# Altium schematic sheet PAGE1-CONTENTS.SchDoc
size A3; DocumentNumber: 1; SheetNumber: 1; SheetTotal: 2
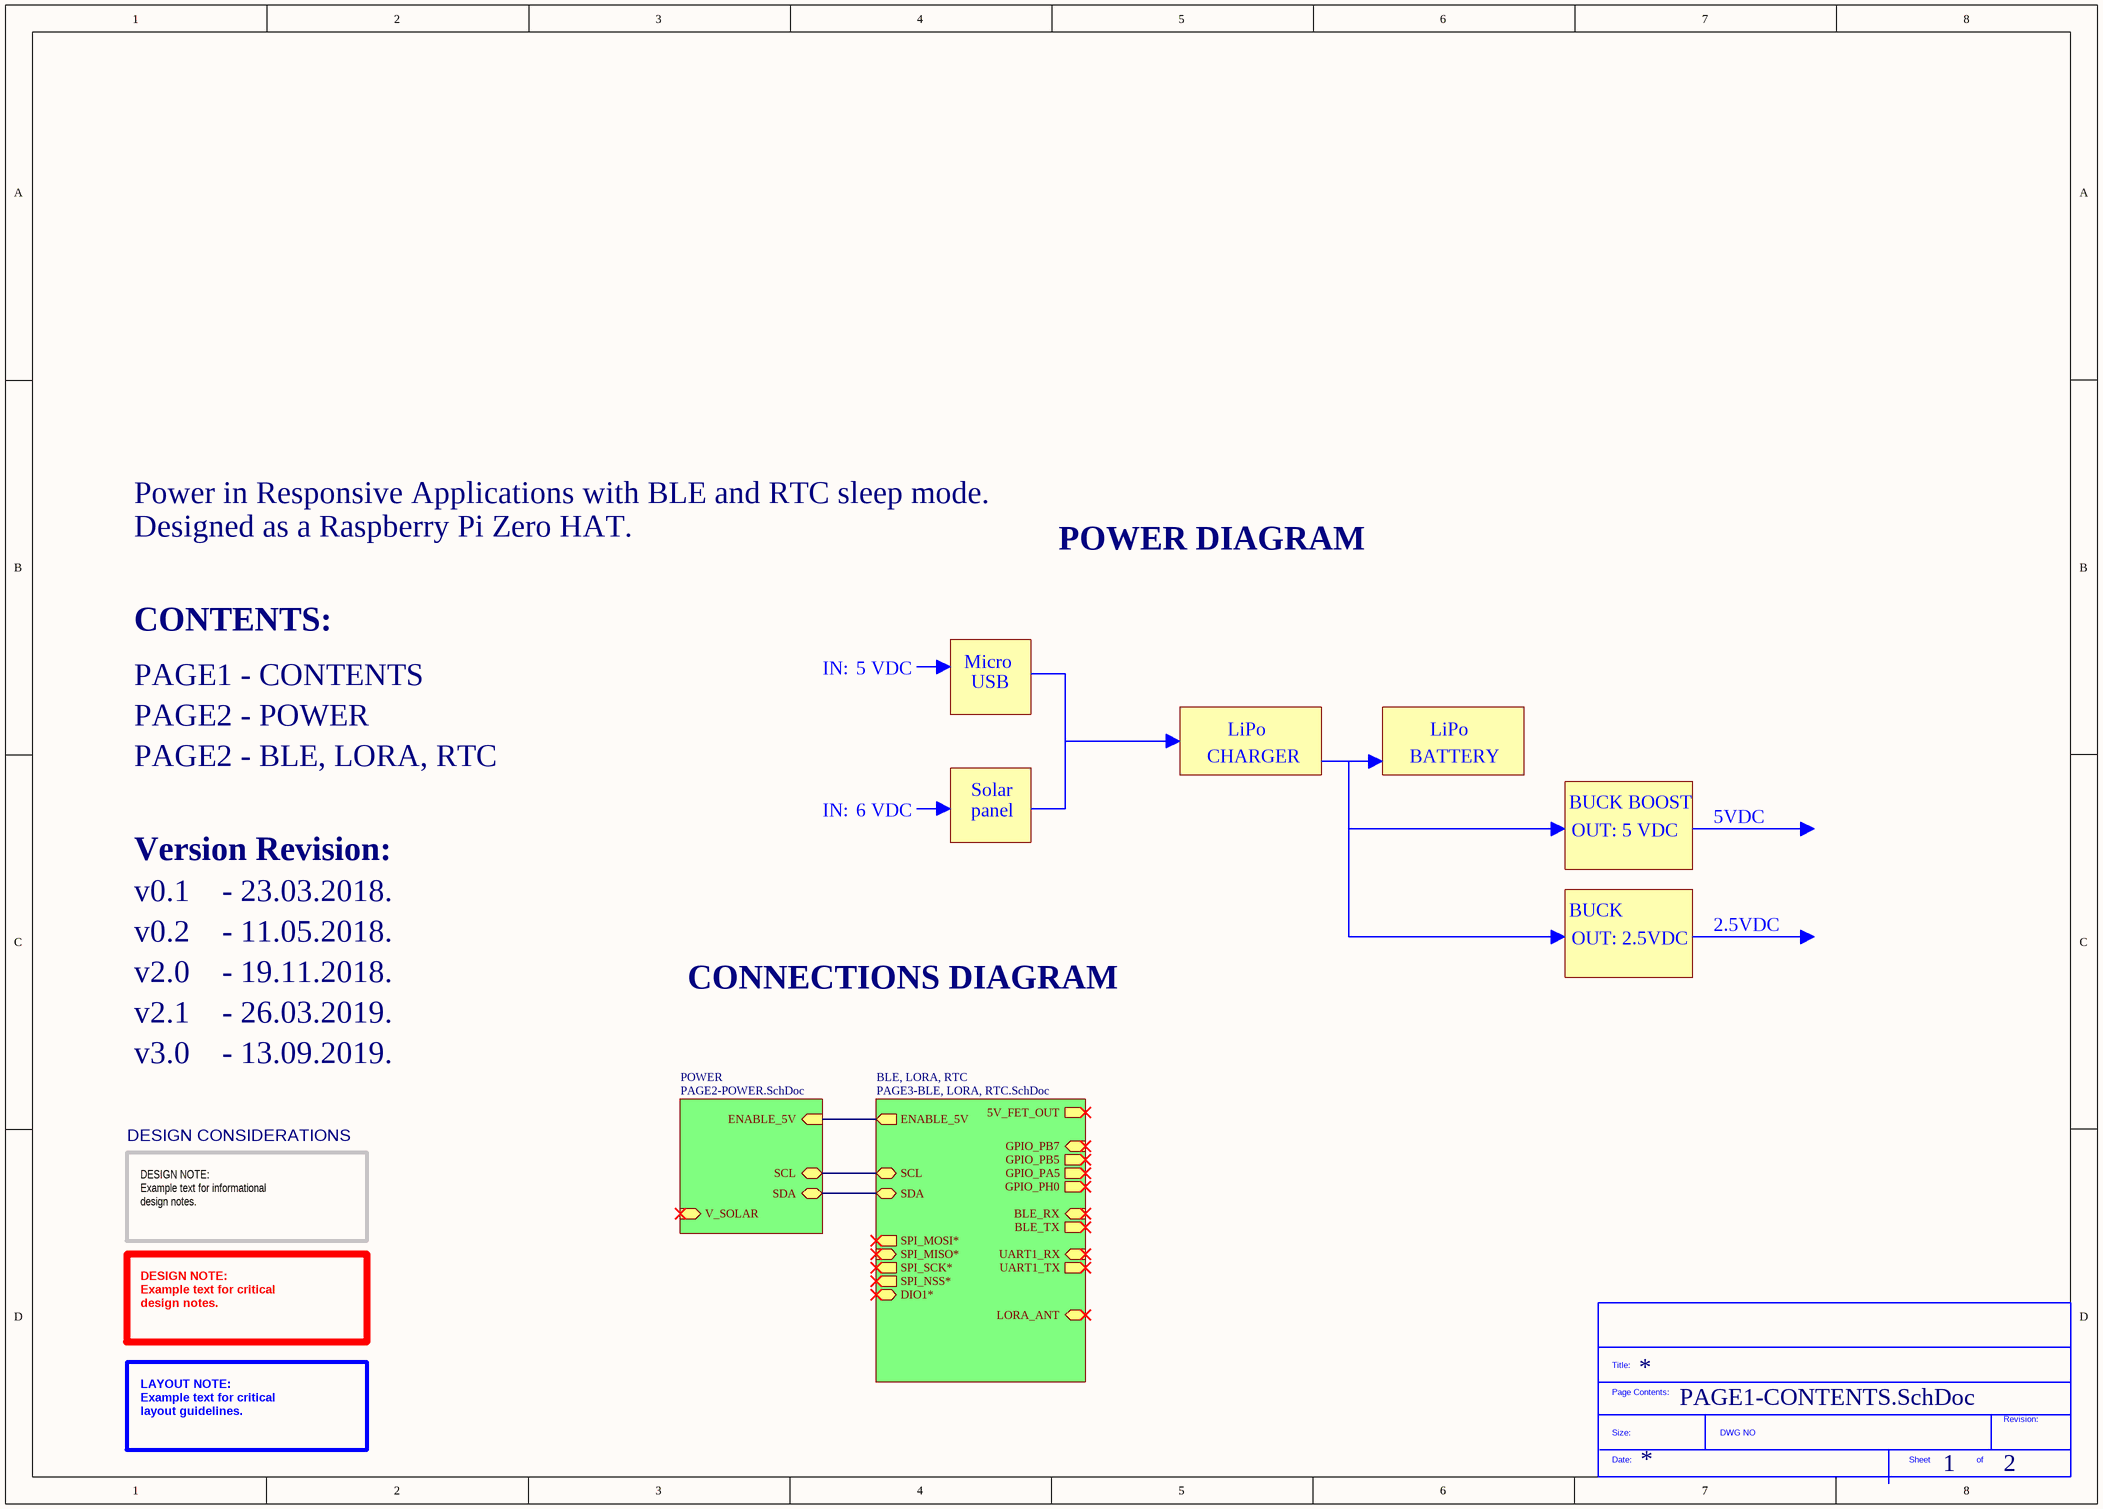
[diagram p0: PAGE1-CONTENTS.SchDoc]

## Parts
*?  SDTitleBlock  (value not drawn)  (graphical)

## Sub-sheets
BLE, LORA, RTC = PAGE3-BLE, LORA, RTC.SchDoc: ENABLE_5V (out), BLE_RX (in), 5V_FET_OUT (out), SDA (bidir), BLE_TX (out), UART1_RX (in), GPIO_PB7 (in), SCL (bidir), UART1_TX (out), GPIO_PH0 (out), GPIO_PA5 (out), LORA_ANT (bidir), GPIO_PB5 (out), SPI_MOSI* (out), SPI_MISO* (in), SPI_SCK* (out), DIO1* (bidir), SPI_NSS* (out)
POWER = PAGE2-POWER.SchDoc: ENABLE_5V (in), SCL (bidir), SDA (bidir), V_SOLAR (in)

## Nets
(unnamed): sheet POWER/ENABLE_5V, sheet BLE, LORA, RTC/ENABLE_5V
(unnamed): sheet POWER/SCL, sheet BLE, LORA, RTC/SCL
(unnamed): sheet POWER/SDA, sheet BLE, LORA, RTC/SDA

## Notes on the sheet
- Power in Responsive Applications with BLE and RTC sleep mode.
- Designed as a Raspberry Pi Zero HAT.
- POWER DIAGRAM
- CONTENTS:
- PAGE1 - CONTENTS
- IN:
- 5 VDC
- Micro
- USB
- PAGE2 - POWER
- PAGE2 - BLE, LORA, RTC
- CHARGER
- LiPo
- BATTERY
- 6 VDC
- Solar
- panel
- BUCK BOOST
- OUT: 5 VDC
- 5VDC
- Version Revision:
- v0.1    - 23.03.2018.
- BUCK
- v0.2    - 11.05.2018.
- v2.0    - 19.11.2018.
- CONNECTIONS DIAGRAM
- OUT: 2.5VDC
- 2.5VDC
- v2.1    - 26.03.2019.
- v3.0    - 13.09.2019.
- DESIGN CONSIDERATIONS
- DESIGN NOTE:
  Example text for informational
  design notes.
- DESIGN NOTE:
  Example text for critical
  design notes.
- LAYOUT NOTE:
  Example text for critical
  layout guidelines.
- (in symbol SDTitleBlock) Title:; Page Contents:; Revision:; Size:; DWG NO; Date:; Sheet; of